# Altium project Cubesat_BMS.PrjPcb (part 2 of 2)

## Sheet Controller.SchDoc
size 297 x 209 mm; SheetNumber: 5; SheetTotal: 9
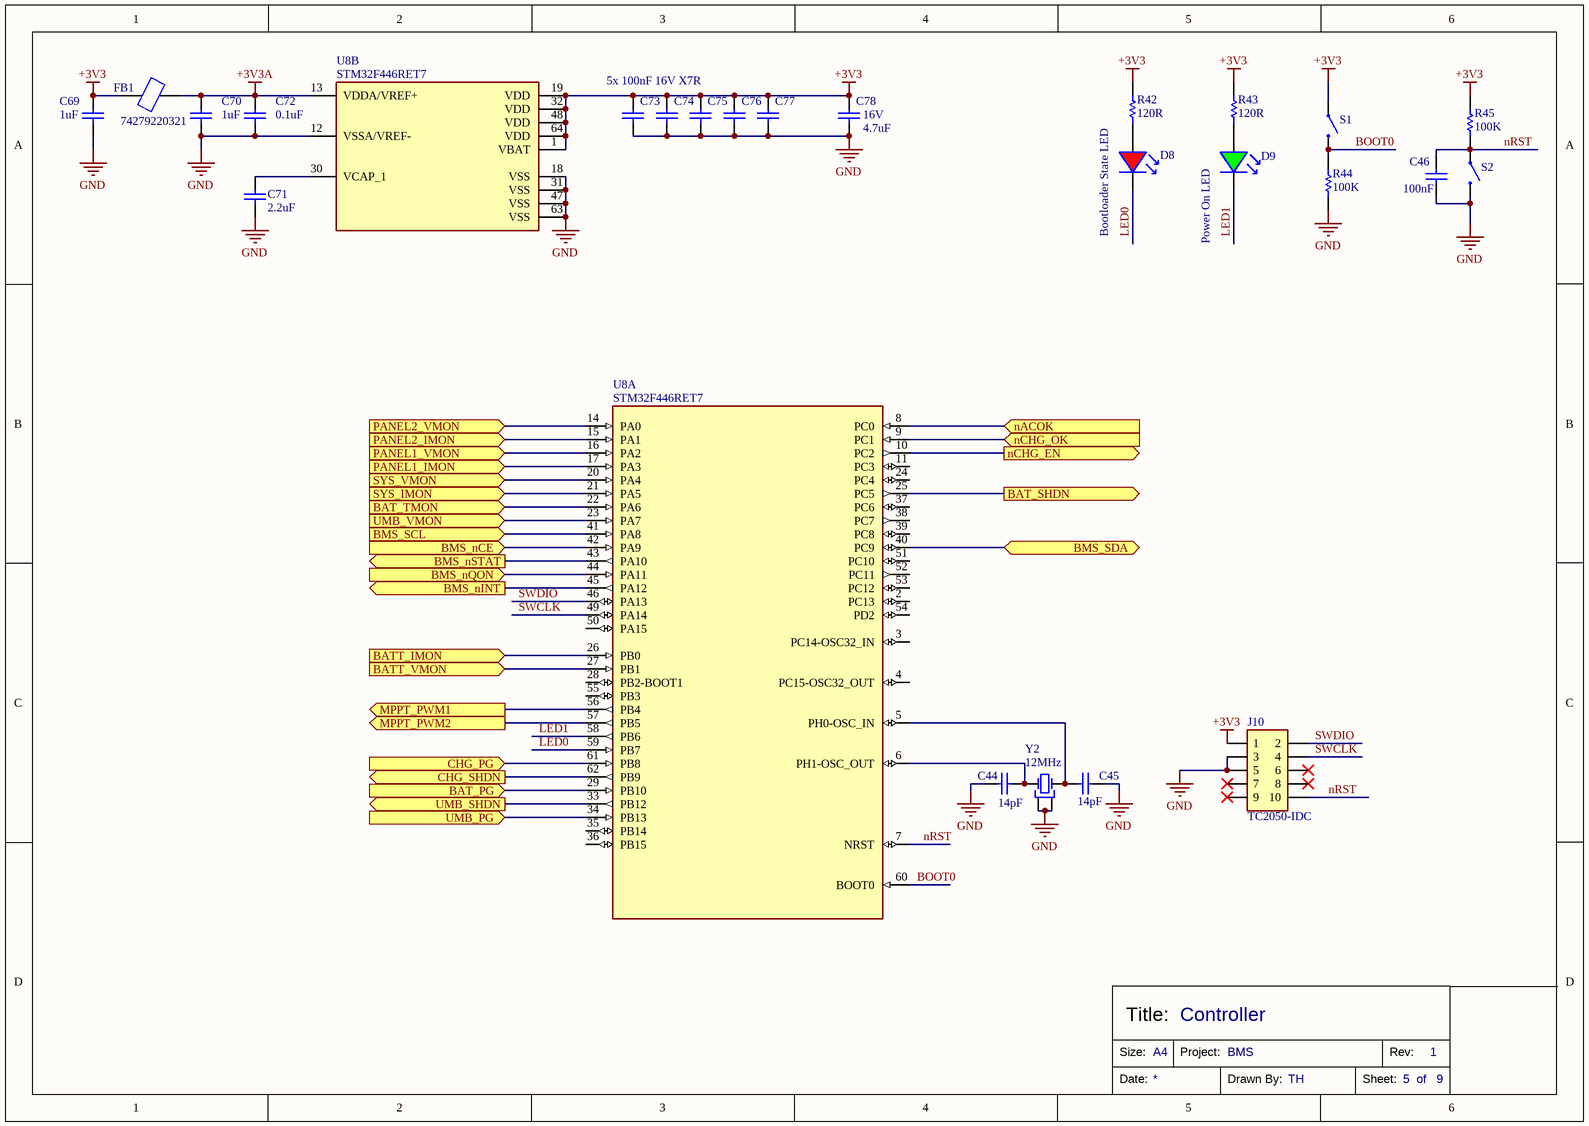
[diagram p7: Controller.SchDoc]

### Parts
C44  Capacitance: 14pF  [CAPC0402X020]  (hidden comment: GJM1555C1H140FB01D)
C45  Capacitance: 14pF  [CAPC0402X020]  (hidden comment: GJM1555C1H140FB01D)
C46  Capacitance: 100nF  [CAPC0603X040]  (hidden comment: CL10B104KO8NNNC)
C69  Capacitance: 1uF  [CAPC0603X040]  (hidden comment: CL10B105KO8NNNC)
C70  Capacitance: 1uF  [CAPC0603X040]  (hidden comment: CL10B105KO8NNNC)
C71  Capacitance: 2.2uF  [CAPC0805X060]  (hidden comment: CL21A225KBFNNNE)
C72  Capacitance: 0.1uF  [CAPC0402X020]  (hidden comment: CL05B104KB5NNNC)
C73  CL05B104KB5NNNC  [CAPC0402X020]  (value not drawn)
C74  CL05B104KB5NNNC  [CAPC0402X020]  (value not drawn)
C75  CL05B104KB5NNNC  [CAPC0402X020]  (value not drawn)
C76  CL05B104KB5NNNC  [CAPC0402X020]  (value not drawn)
C77  CL05B104KB5NNNC  [CAPC0402X020]  (value not drawn)
C78  Voltage Rating: 16V  Capacitance: 4.7uF  [CAPC0805X060]  (hidden comment: CL21B475KOFNFNE)
D8  LTST-C170EKT  [LEDR_0805]  (value not drawn)
D9  LTST-C170GKT  [LEDG_0805]  (value not drawn)
FB1  74279220321  [74279220321]
J10  TC2050-IDC  [TC2050-IDC]  (no BOM)
R42  Resistance: 120R  [RESC0805]  (hidden comment: RMCF0805FT120R)
R43  Resistance: 120R  [RESC0805]  (hidden comment: RMCF0805FT120R)
R44  Resistance: 100K  [RESC0603]  (hidden comment: RMCF0603FT100K)
R45  Resistance: 100K  [RESC0603]  (hidden comment: RMCF0603FT100K)
S1  B3U-1000P  [B3U-1000P]  (value not drawn)
S2  B3U-1000P  [B3U-1000P]  (value not drawn)
U8  STM32F446RET7  [LQFP-64]  (parts A,B of 2)
Y2  Frequency: 12MHz  [830069882]  (hidden comment: 830069882)

### Ports
BAT_PG (in, see Power_Path[2D]), BAT_SHDN (out, see Power_Path[2D]), BAT_TMON (in, see Power_Path[1C], Charger[2D]), BATT_IMON (in, see Power_Path[1D], Battery_Protection[6A]), BATT_VMON (in, see Power_Path[1C]), BMS_nCE (in, see Power_Path[1D]), BMS_nINT (out, see Power_Path[1D]), BMS_nQON (in, see Power_Path[1D]), BMS_nSTAT (out, see Power_Path[1D]), BMS_SCL (in, see Power_Path[1D]), BMS_SDA (bidir, see Power_Path[1D]), CHG_PG (in, see Power_Path[1D]), CHG_SHDN (out, see Power_Path[1D]), MPPT_PWM1 (out, see Power_Path[2C]), MPPT_PWM2 (out, see Power_Path[2C]), nACOK (in, see Power_Path[2D], Charger[3C]), nCHG_EN (out, see Power_Path[2D]), nCHG_OK (in, see Power_Path[2D], Charger[3C]), PANEL1_IMON (in, see Power_Path[2D], MPPT[3A]), PANEL1_VMON (in, see Power_Path[2C], MPPT[3B]), PANEL2_IMON (in, see Power_Path[2D], MPPT[3C]), PANEL2_VMON (in, see Power_Path[2C], MPPT[3D]), SYS_IMON (in, see Power_Path[1C]), SYS_VMON (in, see Power_Path[1C]), UMB_PG (in, see Power_Path[2D]), UMB_SHDN (out, see Power_Path[2D]), UMB_VMON (in, see Power_Path[1D])

### Nets
+3V3: C69.2 C73.2 C74.2 C75.2 C76.2 C77.2 C78.2 FB1.1 J10.1 R42.2 R43.2 R45.2 S1.1 U8.1(VBAT) U8.19(VDD) U8.32(VDD) U8.48(VDD) U8.64(VDD)
+3V3A: C70.2 C72.2 FB1.2 U8.13(VDDA/VREF+)
GND: C44.1 C45.1 C46.1 C69.1 C70.1 C71.1 C72.1 C73.1 C74.1 C75.1 C76.1 C77.1 C78.1 J10.3 J10.5 R44.1 S2.2 U8.12(VSSA/VREF-) U8.18(VSS) U8.31(VSS) U8.47(VSS) U8.63(VSS) Y2.2(OSC1) Y2.4(OSC1)
BOOT0: R44.2 S1.2 U8.60(BOOT0)
LED0: D8.K U8.59(PB7)
LED1: D9.K U8.58(PB6)
nRST: C46.2 J10.10 R45.1 S2.1 U8.7(NRST)
SWCLK: J10.4 U8.49(PA14)
SWDIO: J10.2 U8.46(PA13)
NetC5_2: U8.17(PA3) ; port PANEL1_IMON
NetC17_2: U8.15(PA1) ; port PANEL2_IMON
NetC44_2: C44.2 U8.6(PH1-OSC_OUT) Y2.1(OSC1)
NetC45_2: C45.2 U8.5(PH0-OSC_IN) Y2.3(OSC2)
NetC71_2: C71.2 U8.30(VCAP_1)
NetC86_2: U8.26(PB0) ; port BATT_IMON
NetD8_A: D8.A R42.1
NetD9_A: D9.A R43.1
NetU3_1: U8.16(PA2) ; port PANEL1_VMON
NetU3_6: U8.14(PA0) ; port PANEL2_VMON
NetU4_3: U8.8(PC0) ; port nACOK
NetU4_4: U8.9(PC1) ; port nCHG_OK
NetU8_10: U8.10(PC2) ; port nCHG_EN
NetU8_20: U8.20(PA4) ; port SYS_VMON
NetU8_21: U8.21(PA5) ; port SYS_IMON
NetU8_22: U8.22(PA6) ; port BAT_TMON
NetU8_23: U8.23(PA7) ; port UMB_VMON
NetU8_25: U8.25(PC5) ; port BAT_SHDN
NetU8_27: U8.27(PB1) ; port BATT_VMON
NetU8_29: U8.29(PB10) ; port BAT_PG
NetU8_33: U8.33(PB12) ; port UMB_SHDN
NetU8_34: U8.34(PB13) ; port UMB_PG
NetU8_40: U8.40(PC9) ; port BMS_SDA
NetU8_41: U8.41(PA8) ; port BMS_SCL
NetU8_42: U8.42(PA9) ; port BMS_nCE
NetU8_43: U8.43(PA10) ; port BMS_nSTAT
NetU8_44: U8.44(PA11) ; port BMS_nQON
NetU8_45: U8.45(PA12) ; port BMS_nINT
NetU8_56: U8.56(PB4) ; port MPPT_PWM1
NetU8_57: U8.57(PB5) ; port MPPT_PWM2
NetU8_61: U8.61(PB8) ; port CHG_PG
NetU8_62: U8.62(PB9) ; port CHG_SHDN

Not connected (* = marked no-connect by the designer): J10 6* 7* 8* 9*; U8 2(PC13) 3(PC14-OSC32_IN) 4(PC15-OSC32_OUT) 11(PC3) 24(PC4) 28(PB2-BOOT1) 35(PB14) 36(PB15) 37(PC6) 38(PC7) 39(PC8) 50(PA15) 51(PC10) 52(PC11) 53(PC12) 54(PD2) 55(PB3)

### Notes on the sheet
- 5x 100nF 16V X7R
- Bootloader State LED
- (near D9) Power On LED
- Controller
- Size:
- Title:
- A4
- Project:
- Rev:
- Date:
- Drawn By:
- Sheet:
- of

### Library data of the parts
C44 C45 = CAPC0402: 14 pF ±1% 50V Ceramic Capacitor C0G, NP0 0402 (1005 Metric); Part Number: GJM1555C1H140FB01D; Tolerance: 1%; Distributor Part Number: 2266-GJM1555C1H140FB01DTR-ND; Case Code: 0402; Distributor: Digikey; Voltage Rating: 50V
C46 = CAPC0603: 0.1 µF ±10% 16V Ceramic Capacitor X7R 0603 (1608 Metric); Manufacturer Part Number: CL10B104KO8NNNC; Tolerance: 10%; Distributor Part number: 1276-1005-1-ND; Case Code: 0603; Voltage Rating: 16V; Distributor: Digikey
C69 C70 = CAPC0603: 1 µF ±10% 16V Ceramic Capacitor X7R 0603 (1608 Metric); Manufacturer Part Number: CL10B105KO8NNNC; Tolerance: 10%; Distributor Part number: 1276-1019-1-ND; Case Code: 0603; Voltage Rating: 16V; Distributor: Digikey
C71 = CL21A225KBFNNNE: 2.2uF ±10% 25V Ceramic Capacitor X7R 0805 (2012 Metric); Part Number: CL21A225KBFNNNE; Distributor Part Number: 1276-6702-1-ND; Tolerance: 10%; Case Code: 0805; Distributor: Digikey; Voltage Rating: 25V
C72 = CL05B104KB5NNNC: as C41 on sheet Battery_Protection; Part Number: CL05B104KB5NNNC; Tolerance: 10%; Distributor Part Number: 1276-CL05B104KB5NNNCCT-ND; Case Code: 0402; Distributor: Digikey; Voltage Rating: 50V
C73-C77 = CL05B104KB5NNNC: 0.1 µF ±10% 50V Ceramic Capacitor X7R 0402 (1005 Metric); Capacitance: 0.1uF; Part Number: CL05B104KB5NNNC; Tolerance: 10%; Distributor Part Number: 1276-CL05B104KB5NNNCCT-ND; Case Code: 0402; Distributor: Digikey; Voltage Rating: 50V
C78 = CL21B475KOFNFNE: 4.7 µF ±10% 16V Ceramic Capacitor X7R 0805 (2012 Metric); Distributor Part Number: 1276-2970-1-ND; Tolerance: 10%; Case Code: 0805; Distributor: Digikey; Part Number: CL21B475KOFNFNE
D8 = LEDR0805: Red 621nm LED Indication - Discrete 2V 0805 (2012 Metric); Manufacturer Part Number: LTST-C170EKT; Distributor Part Number: 160-1178-1-ND; Colour: Red; Operating Temperature: *; Distributor: Digikey
D9 = LEDG0805: Green 569nm LED Indication - Discrete 2.1V 0805 (2012 Metric); Manufacturer Part Number: LTST-C170GKT; Distributor Part Number: 160-1179-1-ND; Colour: Green; Operating Temperature: *; Distributor: Digikey
FB1 = 74279220321: Ferrite Bead 320 Ohms @ 100 MHz 1 Ferrite Bead 0805 (2012 Metric) 2.5A 50mOhm; Part Number: 74279220321; Distributor Part Number: 732-6125-1-ND; Distributor: Digikey; Operating Temperature: -55°C ~ 125°C; Impedance: 320 Ohms @ 100 MHz; Current Rating: 2.5A; DCR: 50mOhm
J10 = TC2050-IDC: JTAG Pogo Programmer Pads; Programmer Part Number: TC2050-IDC
R42 R43 = RMCF0805FT120R: 120 Ohms ±1% 0.125W, 1/8W Chip Resistor 0805 (2012 Metric) Automotive AEC-Q200 Thick Film; Part Number: RMCF0805FT120R; Tolerance: 1%; Distributor Part Number: 738-RMCF0805FT120RCT-ND; Distributor: Digikey; Case Code: 0805
R44 R45 = RMCF0603FT100K: 100 kOhms ±1% 0.1W, 1/10W Chip Resistor 0603 (1608 Metric) Automotive AEC-Q200 Thick Film; Part Number: RMCF0603FT100K; Tolerance: 1%; Distributor: Digikey; Distributor Part Number: RMCF0603FT100KCT-ND; Case Code: 0603
S1 S2 = B3U-1000P: Tactile Switch SPST-NO Top Actuated Surface Mount; Part Number: B3U-1000P; Distributor: Digikey; Distributor Part Number: SW1020CT-ND; Operating Temperature: -25°C ~ 70°C
U8 = STM32F446RET7: ARM® Cortex®-M4 STM32F4 Microcontroller IC 32-Bit 180MHz 512KB (512K x 8) FLASH 64-LQFP (10x10); Part Number: STM32F446RET6; RAM Size: 128K x 8; Voltage - Supply: 1.7V ~ 3.6V; Distributor: Mouser; Distributor Part Number: 511-STM32F446RET7; Core Size: 32-Bit; Speed: 180MHz; ComponentLink1Description: Datasheet; ComponentLink1URL: *; Operating Temperature: -40C~105C
Y2 = 830069882: Crystals 12.0 MHZ 18PF 20PPM 120OHM; Load Capacitance: 10pF; ESR: 100R; Distributor Part Number: *; Part Number: 830069882; Operating Temperature: -40C to 125C; Distributor: *

## Sheet Step_Down.SchDoc
size 297 x 209 mm; SheetNumber: 9; SheetTotal: 9
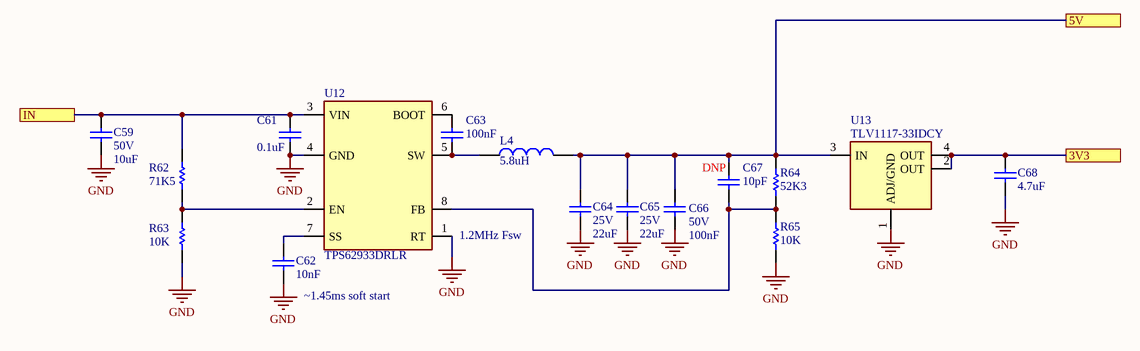
[diagram p8: Step_Down.SchDoc]

### Parts
C59  Voltage Rating: 50V  Capacitance: 10uF  [CAPC1210X090]  (hidden comment: CL32B106KBJNNNE)
C61  Capacitance: 0.1uF  [CAPC0402X020]  (hidden comment: CL05B104KB5NNNC)
C62  Capacitance: 10nF  [CAPC0603X060]  (hidden comment: CL10B103KB8NNNC)
C63  Capacitance: 100nF  [CAPC0603X040]  (hidden comment: C0603C104K5RACTU)
C64  Voltage Rating: 25V  Capacitance: 22uF  [CAPC1210X090]  (hidden comment: CL32B226KAJNNNE)
C65  Voltage Rating: 25V  Capacitance: 22uF  [CAPC1210X090]  (hidden comment: CL32B226KAJNNNE)
C66  Voltage Rating: 50V  Capacitance: 100nF  [CAPC0603X040]  (hidden comment: C0603C104K5RACTU)
C67  Capacitance: 10pF  [CAPC0603X040]  (hidden comment: C0603C104K5RACTU)
C68  Capacitance: 4.7uF  [CAPC0805X060]  (hidden comment: CL21B475KOFNFNE)
L4  744316560  [744316560]  (value not drawn)
R62  Resistance: 71K5  [RESC0603]  (hidden comment: RMCF0603FT71K5)
R63  Resistance: 10K  [RESC0603]  (hidden comment: RMCF0603FT10K0)
R64  Resistance: 52K3  [RESC0603]  (hidden comment: RMCF0603FT52K3)
R65  Resistance: 10K  [RESC0603]  (hidden comment: RMCF0603FT10K0)
U12  TPS62933DRLR  [SOT-583]
U13  TLV1117-33IDCY  [TLV1117-33IDCY]

### Ports
3V3 (see Power_Path[6C]), 5V (see Power_Path[6C]), IN (see Power_Path[5C])

### Nets
GND: C59.1 C61.1 C62.1 C64.1 C65.1 C66.1 C68.1 R63.1 R65.1 U12.1(RT) U12.4(GND) U13.1(ADJ/GND)
NetC59_2: C59.2 C61.2 R62.2 U12.3(VIN) ; port IN
NetC62_2: C62.2 U12.7(SS)
NetC63_1: C63.1 L4.1 U12.5(SW)
NetC63_2: C63.2 U12.6(BOOT)
NetC64_2: C64.2 C65.2 C66.2 C67.2 L4.2 R64.2 U13.3(IN) ; port 5V
NetC67_1: C67.1 R64.1 R65.2 U12.8(FB)
NetC68_2: C68.2 U13.2(OUT) U13.4(OUT) ; port 3V3
NetR62_1: R62.1 R63.2 U12.2(EN)

### Notes on the sheet
- (near L4) 5.8uH
- (near C67) DNP
- (near U12) 1.2MHz Fsw
- (near C62) ~1.45ms soft start
- Size:
- Title:
- Project:
- Rev:
- Date:
- Drawn By:
- Sheet:

### Library data of the parts
C59 = CL32B106KBJNNNE: 10 µF ±10% 50V Ceramic Capacitor X7R 1210 (3225 Metric); Manufacturer Part Number: CL32B106KBJNNNE; Distributor Part Number: 1276-3387-1-ND; Tolerance: 10%; Case Code: 1210; Distributor: Digikey
C61 = CL05B104KB5NNNC: as C41 on sheet Battery_Protection; Part Number: CL05B104KB5NNNC; Tolerance: 10%; Distributor Part Number: 1276-CL05B104KB5NNNCCT-ND; Case Code: 0402; Distributor: Digikey; Voltage Rating: 50V
C62 = CL10B103KB8NNNC: 10nF ±10% 50V Ceramic Capacitor X7R 0603 (1608 Metric); Part Number: CL10B103KB8NNNC; Distributor Part Number: 1276-1009-1-ND; Tolerance: 10%; Case Code: 0603; Distributor: Digikey; Voltage Rating: 50V
C63 C66 = C0603C104K5RACTU: 0.1 µF ±10% 50V Ceramic Capacitor X7R 0603 (1608 Metric); Distributor Part Number: 399-C0603C104K5RACTUCT-ND; Tolerance: 10%; Case Code: 0603; Distributor: Digikey
  C63: Manufacturer Part Number: C0603C104K5RACTU; Voltage Rating: 50V
  C66: Part Number: C0603C104K5RACTU
C64 C65 = CL32B226KAJNNNE: 22 µF ±10% 25V Ceramic Capacitor X7R 1210 (3225 Metric); Part Number: CL32B226KAJNNNE; Distributor Part Number: 1276-3392-1-ND; Tolerance: 10%; Case Code: 1210; Distributor: Digikey
C67 = C0603C100J5GACTU: 10 pF ±5% 50V Ceramic Capacitor C0G, NP0 0603 (1608 Metric); Tolerance: 10%; Part Number: C0603C100J5GACTU; Distributor Part Number: 399-C0603C100J5GACTUCT-ND; Case Code: 0603; Distributor: Digikey; Voltage Rating: 50V
C68 = CL21B475KOFNFNE: as C78 on sheet Controller; Part Number: CL21B475KOFNFNE; Distributor Part Number: 1276-2970-1-ND; Tolerance: 10%; Case Code: 0805; Distributor: Digikey; Voltage Rating: 16V
L4 = 744316560: Inductor 5.6uH 4.5A Shielded 28.5mOhm SMD; Saturation Current: 4.6A; Part Number: 744316560; Distributor Part Number: 732-6183-1-ND; Distributor: Digikey; Current Rating: 4.5A; DCR: 28.5mOhm
R62 = RMCF0603FT71K5: 71.5 kOhms ±1% 0.1W, 1/10W Chip Resistor 0603 (1608 Metric) Automotive AEC-Q200 Thick Film; Part Number: RMCF0603FT71K5; Tolerance: 1%; Distributor: Digikey; Distributor Part Number: RMCF0603FT71K5CT-ND; Case Code: 0603
R63 R65 = RMCF0603FT10K0: 10 kOhms ±1% 0.1W, 1/10W Chip Resistor 0603 (1608 Metric) Automotive AEC-Q200 Thick Film; Tolerance: 1%; Distributor Part Number: RMCF0603FT10K0CT-ND; Distributor: Digikey; Case Code: 0603; Part Number: RMCF0603FT10K0
R64 = RMCF0603FT52K3: 52.3 kOhms ±1% 0.1W, 1/10W Chip Resistor 0603 (1608 Metric) Automotive AEC-Q200 Thick Film; Part Number: RMCF0603FT52K3; Tolerance: 1%; Distributor: Digikey; Distributor Part Number: RMCF0603FT174KCT-ND; Case Code: 0603
U12 = TPS62933DRLR: Buck Switching Regulator IC Positive Adjustable 0.8V 1 Output 3A SOT-583; Voltage - Input (Min): 3.8V; Voltage - Input (Max): 30V; Voltage - Output (Max): 22V; Part Number: TPS62933DRLR; Distributor Part Number: 296-TPS62933DRLRCT-ND; Distributor: Digikey; Operating Temperature: -40°C ~ 150°C (TJ); Current Output: 3A; Voltage - Output (Min): 0.8V
U13 = TLV1117-33IDCY: 3.3V 800-mA, 15-V, linear voltage regulator 4-SOT-223 -40 to 125; Output Current: 800mA; Input Voltage - Min: 4.7V; Input Voltage - Max: 15V; Dropout Voltage: 1.2V; Part Number: TLV1117-33IDCY; Output Voltage: 3.3V; Operating Temperature: -40C~125C; Distributor: Digikey; Distributor Part Number: 296-26777-5-ND

## Nets that join several sheets
+3V3: Power_Path (R82.2 R83.2), Battery_Protection (C83.2 U15.1 U15.3), Battery_eFuse (R19.2), Umbilical_eFuse (R50.2), Charger (R73.2), Controller (18 pins)
+3V3A: Power_Path (U10.5 U11.8), Battery_Protection (C84.1 U16.6), Charger (U14.8), MPPT (5 pins), Controller (C70.2 C72.2 FB1.2 U8.13)
BAT-: Power_Path (C81.1 J3.4 R57.1), Battery_Protection (17 pins)
GND: Top_Level (8 pins), Power_Path (35 pins), Battery_Protection (11 pins), Battery_eFuse (8 pins), Umbilical_eFuse (8 pins), Charger (21 pins), MPPT (25 pins), Controller (24 pins), Step_Down (12 pins)
NetC5_2: MPPT (C5.2 R4.2 U1.1), Controller (U8.17)
NetC6_2: Battery_eFuse (R21.2 U5.6), Umbilical_eFuse (R52.2 U9.6), Charger (C28.2 C29.2 R12.2 U4.10), MPPT (10 pins)
NetC17_2: MPPT (C17.2 R8.2 U2.1), Controller (U8.15)
NetC59_2: Battery_eFuse (R16.2 U5.5), Umbilical_eFuse (R47.2 U9.5), Charger (R70.2 U17.5), Step_Down (C59.2 C61.2 R62.2 U12.3)
NetC86_2: Battery_Protection (C86.2 U16.1), Controller (U8.26)
NetQ3_G: Battery_eFuse (Q3.G R15.2), Umbilical_eFuse (Q6.G R46.2), Charger (Q7.G R69.2)
NetR19_1: Battery_eFuse (R19.1 U5.3), Umbilical_eFuse (R50.1 U9.3), Charger (R73.1 U17.3)
NetU3_1: MPPT (U3.1 U3.2), Controller (U8.16)
NetU3_6: MPPT (U3.6 U3.7), Controller (U8.14)
NetU4_3: Charger (U4.3), Controller (U8.8)
NetU4_4: Charger (U4.4), Controller (U8.9)
NetU8_22: Charger (U14.1 U14.2), Controller (U8.22)